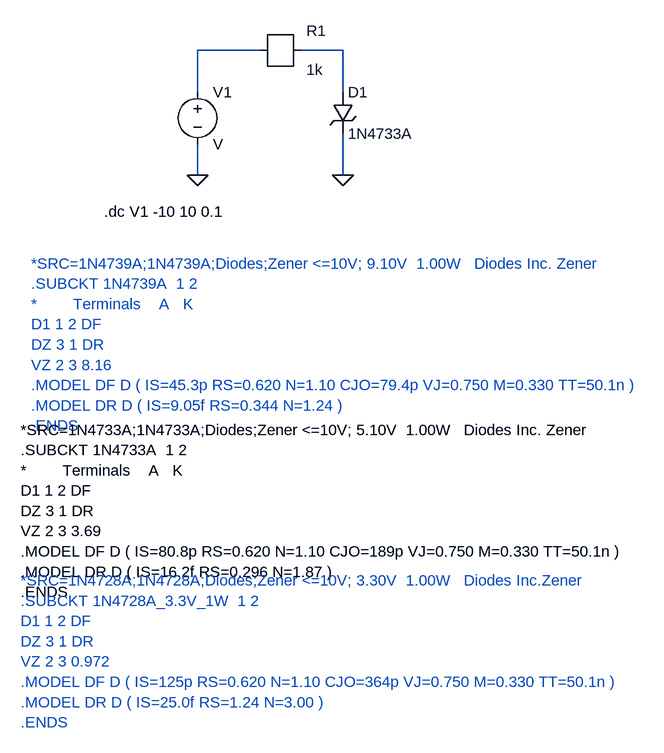
[diagram p0: schematic lab2_ex3.asc]
lab2_ex3.asc, the LTspice schematic file:
Version 4
SHEET 1 1560 1200
WIRE 304 176 208 176
WIRE 432 176 368 176
WIRE 208 240 208 176
WIRE 432 240 432 176
WIRE 208 368 208 320
WIRE 432 368 432 304
FLAG 432 368 0
FLAG 208 368 0
SYMBOL zener 416 240 R0
SYMATTR InstName D1
SYMATTR Value 1N4733A
SYMATTR Prefix X
SYMBOL voltage 208 224 R0
SYMATTR InstName V1
SYMBOL r 304 176 R0
SYMATTR InstName R1
SYMATTR Value 1k
TEXT 64 424 Left 2 !.dc V1 -10 10 0.1
TEXT -48 504 Left 2 ;*SRC=1N4739A;1N4739A;Diodes;Zener <=10V; 9.10V  1.00W   Diodes Inc. Zener\n.SUBCKT 1N4739A  1 2\n*        Terminals    A   K\nD1 1 2 DF\nDZ 3 1 DR\nVZ 2 3 8.16\n.MODEL DF D ( IS=45.3p RS=0.620 N=1.10 CJO=79.4p VJ=0.750 M=0.330 TT=50.1n )\n.MODEL DR D ( IS=9.05f RS=0.344 N=1.24 )\n.ENDS
TEXT -64 760 Left 2 !*SRC=1N4733A;1N4733A;Diodes;Zener <=10V; 5.10V  1.00W   Diodes Inc. Zener\n.SUBCKT 1N4733A  1 2\n*        Terminals    A   K\nD1 1 2 DF\nDZ 3 1 DR\nVZ 2 3 3.69\n.MODEL DF D ( IS=80.8p RS=0.620 N=1.10 CJO=189p VJ=0.750 M=0.330 TT=50.1n )\n.MODEL DR D ( IS=16.2f RS=0.296 N=1.87 )\n.ENDS
TEXT -64 992 Left 2 ;*SRC=1N4728A;1N4728A;Diodes;Zener <=10V; 3.30V  1.00W   Diodes Inc.Zener\n.SUBCKT 1N4728A_3.3V_1W  1 2\nD1 1 2 DF\nDZ 3 1 DR\nVZ 2 3 0.972 \n.MODEL DF D ( IS=125p RS=0.620 N=1.10 CJO=364p VJ=0.750 M=0.330 TT=50.1n )\n.MODEL DR D ( IS=25.0f RS=1.24 N=3.00 )\n.ENDS

The netlist it stands for:
* lab2_ex3.asc
XD1 N002 0 1N4733A  ; pins + -
V1 N001 0 V
R1 N002 N001 1k
.dc V1 -10 10 0.1
* *SRC=1N4739A;1N4739A;Diodes;Zener <=10V; 9.10V  1.00W   Diodes Inc. Zener
* .SUBCKT 1N4739A  1 2
* *        Terminals    A   K
* D1 1 2 DF
* DZ 3 1 DR
* VZ 2 3 8.16
* .MODEL DF D ( IS=45.3p RS=0.620 N=1.10 CJO=79.4p VJ=0.750 M=0.330 TT=50.1n )
* .MODEL DR D ( IS=9.05f RS=0.344 N=1.24 )
* .ENDS
*SRC=1N4733A;1N4733A;Diodes;Zener <=10V; 5.10V  1.00W   Diodes Inc. Zener
.SUBCKT 1N4733A  1 2
*        Terminals    A   K
D1 1 2 DF
DZ 3 1 DR
VZ 2 3 3.69
.MODEL DF D ( IS=80.8p RS=0.620 N=1.10 CJO=189p VJ=0.750 M=0.330 TT=50.1n )
.MODEL DR D ( IS=16.2f RS=0.296 N=1.87 )
.ENDS
* *SRC=1N4728A;1N4728A;Diodes;Zener <=10V; 3.30V  1.00W   Diodes Inc.Zener
* .SUBCKT 1N4728A_3.3V_1W  1 2
* D1 1 2 DF
* DZ 3 1 DR
* VZ 2 3 0.972
* .MODEL DF D ( IS=125p RS=0.620 N=1.10 CJO=364p VJ=0.750 M=0.330 TT=50.1n )
* .MODEL DR D ( IS=25.0f RS=1.24 N=3.00 )
* .ENDS
.backanno
.end